# EAGLE schematic switch_eval_box_redo_v2 (EAGLE 9.6.2)
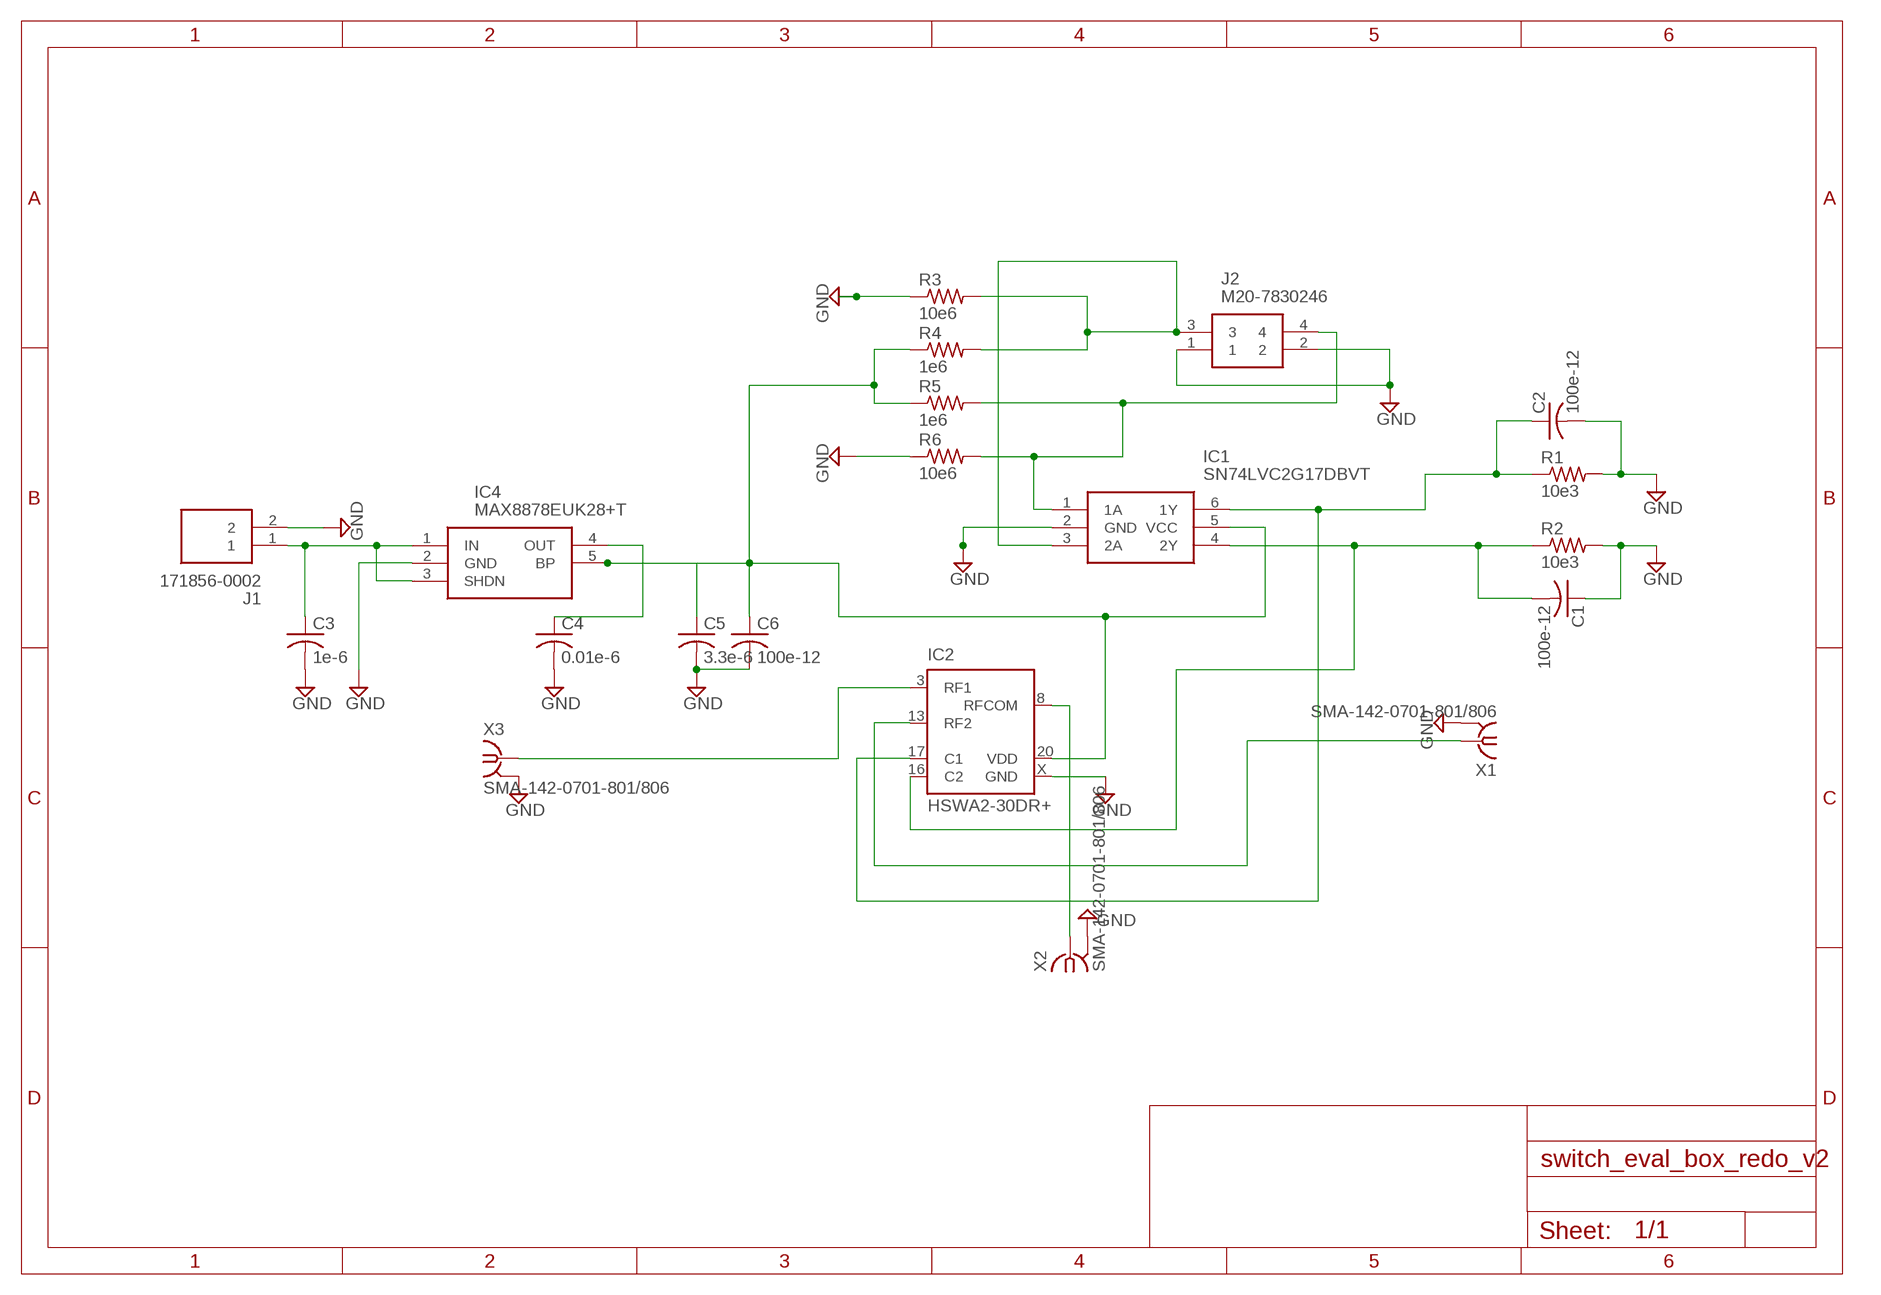
[diagram p0: schematic, sheet 1]

## Parts
C1  100e-12  C-USC0603  [C0603]
C2  100e-12  C-USC0603  [C0603]
C3  1e-6  C-USC0603  [C0603]
C4  0.01e-6  C-USC0603  [C0603]
C5  3.3e-6  C-USC0603  [C0603]
C6  100e-12  C-USC0603  [C0603]
IC1  SN74LVC2G17DBVT  [SOT95P280X145-6N]
IC2  HSWA2-30DR+  [DG983-1]
IC4  MAX8878EUK28+T  [SOT95P280X145-5N]
J1  171856-0002  [SHDR2W90P0X254_1X2_493X635X106]
J2  M20-7830246  [M207830246]
R1  10e3  R-US_R0603  [R0603]
R2  10e3  R-US_R0603  [R0603]
R3  10e6  R-US_R0603  [R0603]
R4  1e6  R-US_R0603  [R0603]
R5  1e6  R-US_R0603  [R0603]
R6  10e6  R-US_R0603  [R0603]
X1  SMA-142-0701-801/806  [J502-ND-142-0701-801/806]
X2  SMA-142-0701-801/806  [J502-ND-142-0701-801/806]
X3  SMA-142-0701-801/806  [J502-ND-142-0701-801/806]

## Nets
GND: C1.1 C2.2 C3.2 C4.2 C5.2 C6.2 IC1.2(GND) IC2.X(GND) IC4.2(GND) J1.2 J2.1 J2.2 R1.2 R2.2 R3.1 R6.1 X1.G@1 X1.G@2 X1.G@3 X1.G@4 X2.G@1 X2.G@2 X2.G@3 X2.G@4 X3.G@1 X3.G@2 X3.G@3 X3.G@4
N$1: IC1.3(2A) J2.3 R3.2 R4.2
N$2: C3.1 IC4.1(IN) IC4.3(SHDN) J1.1
N$3: C4.1 IC4.4(OUT)
N$4: IC1.1(1A) J2.4 R5.2 R6.2
N$7: C5.1 C6.1 IC1.5(VCC) IC2.20(VDD) IC4.5(BP) R4.1 R5.1
N$8: IC2.3(RF1) X3.1
N$9: C2.1 IC1.6(1Y) IC2.17(C1) R1.1
N$10: IC2.13(RF2) X1.1
N$11: C1.2 IC1.4(2Y) IC2.16(C2) R2.1
N$12: IC2.8(RFCOM) X2.1

## Power pins joined to a net without a drawn wire
GND: IC2.1(GND) IC2.2(GND) IC2.4(GND) IC2.5(GND) IC2.6(GND) IC2.7(GND) IC2.9(GND) IC2.10(GND) IC2.11(GND) IC2.12(GND) IC2.14(GND) IC2.15(GND) IC2.18(GND) IC2.19(GND)

## Library data of the parts
C1-C6 = rcl:C-US: CAPACITOR, American symbol; SPICEPREFIX: C
IC1 = SN74LVC2G17DBVT:SN74LVC2G17DBVT: DUAL SCHMITT-TRIGGER BUFFER Source: Datasheet <http://www.ti.com/lit/gpn/SN74LVC2G17>; DESCRIPTION: DUAL SCHMITT-TRIGGER BUFFER; HEIGHT: 1.45mm; MANUFACTURER_NAME: Texas Instruments; MANUFACTURER_PART_NUMBER: SN74LVC2G17DBVT; MOUSER_PART_NUMBER: 595-SN74LVC2G17DBVT; MOUSER_PRICE-STOCK: https://www.mouser.com/Search/Refine.aspx?Keyword=595-SN74LVC2G17DBVT; RS_PART_NUMBER: 6628944P; RS_PRICE-STOCK: http://uk.rs-online.com/web/p/products/6628944P
IC2 = minicircuits:HSWA2-30DR+: SPDT RF SWITCH Absorptive RF Switch with internal driver Source: http://www.minicircuits.com .. HSWA2-30DR+.pdf; OC_FARNELL: unknown; OC_NEWARK: unknown
IC4 = MAX8878EUK28+T:MAX8878EUK28+T: LDO Voltage Regulators Low-Noise, Low-Dropout, 150mA Linear Regulators with 2982 Pinout Source: Datasheet <https://www.mouser.com/datasheet/2/256/MAX8878-1389229.pdf>; DESCRIPTION: LDO Voltage Regulators Low-Noise, Low-Dropout, 150mA Linear Regulators with 2982 Pinout; HEIGHT: 1.45mm; MANUFACTURER_NAME: Maxim Integrated; MANUFACTURER_PART_NUMBER: MAX8878EUK28+T
J1 = 171856-0002:171856-0002: KK 254 RPC Pin Header friction lock 2way Molex KK 254 Series, Series Number 171856, 2.54mm Pitch 2 Way 1 Row Straight PCB Header, Through Hole Source: Datasheet <https://www.digikey.com/product-detail/en/molex/1718560002/WM10153-ND/4423109>; ALLIED_NUMBER: 70314268; ALLIED_PRICE-STOCK: https://www.alliedelec.com/molexincorporated-171856-0002/70314268/; DESCRIPTION: KK 254 RPC Pin Header friction lock 2way Molex KK 254 Series, Series Number 171856, 2.54mm Pitch 2 Way 1 Row Straight PCB Header, Through Hole; HEIGHT: 10.61mm; MANUFACTURER_NAME: Molex; MANUFACTURER_PART_NUMBER: 171856-0002; MOUSER_PART_NUMBER: 538-171856-0002; MOUSER_PRICE-STOCK: https://www.mouser.com/Search/Refine.aspx?Keyword=538-171856-0002; RS_PART_NUMBER: 7922884P; RS_PRICE-STOCK: http://uk.rs-online.com/web/p/products/7922884P
J2 = M20-7830246:M20-7830246: HARWIN 2.54mm 4 Way 2 Row Straight PCB Socket Through Hole Socket Strip Source: Datasheet <https://cdn.harwin.com/pdfs/M20-783.pdf>; ALLIED_NUMBER: R1052762; ALLIED_PRICE-STOCK: https://www.alliedelec.com/harwin-m20-7830246/R1052762/; DESCRIPTION: HARWIN 2.54mm 4 Way 2 Row Straight PCB Socket Through Hole Socket Strip; HEIGHT: 8.65mm; MANUFACTURER_NAME: HARWIN; MANUFACTURER_PART_NUMBER: M20-7830246; MOUSER_PART_NUMBER: 855-M20-7830246; MOUSER_PRICE-STOCK: https://www.mouser.com/Search/Refine.aspx?Keyword=855-M20-7830246; RS_PART_NUMBER: 6816839P; RS_PRICE-STOCK: http://uk.rs-online.com/web/p/products/6816839P
R1-R6 = rcl:R-US_: RESISTOR, American symbol; SPICEPREFIX: R
X1-X3 = con-coax:SMA-: SMA 50 Ohm End Launch Jack Receptacle - Round Contact Johnson Components Source: www.johnsoncomponents.com .. J502-ND.pdf; MF: JOHNSON COMPONENTS; MPN: 142-0701-801; OC_FARNELL: 1608592; OC_NEWARK: 90F2624